# EAGLE board foo (EAGLE 6.6.0), part 1 of 2
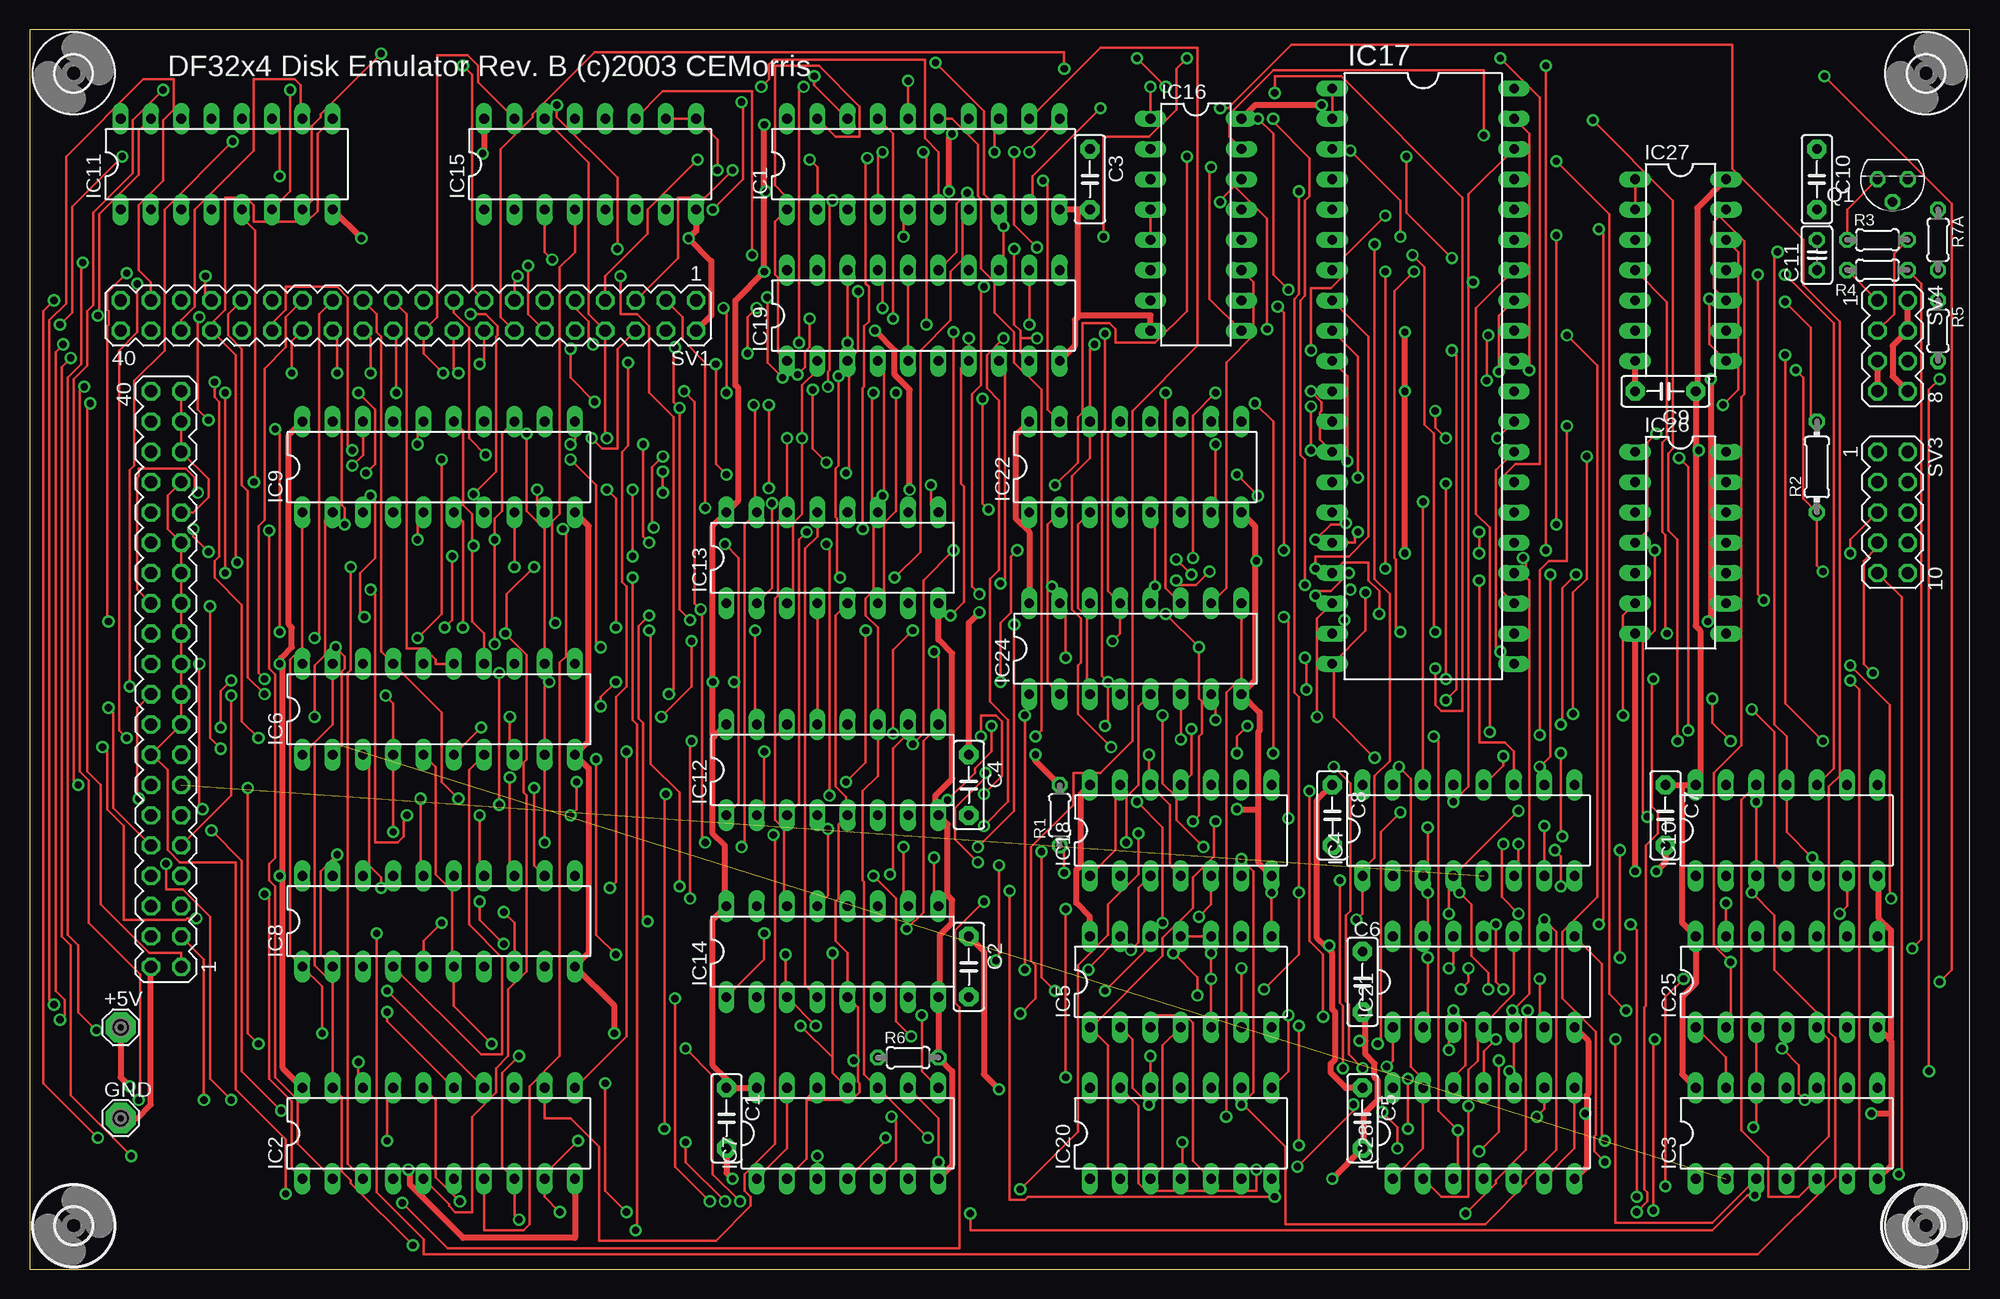
[diagram p2: board, top side]
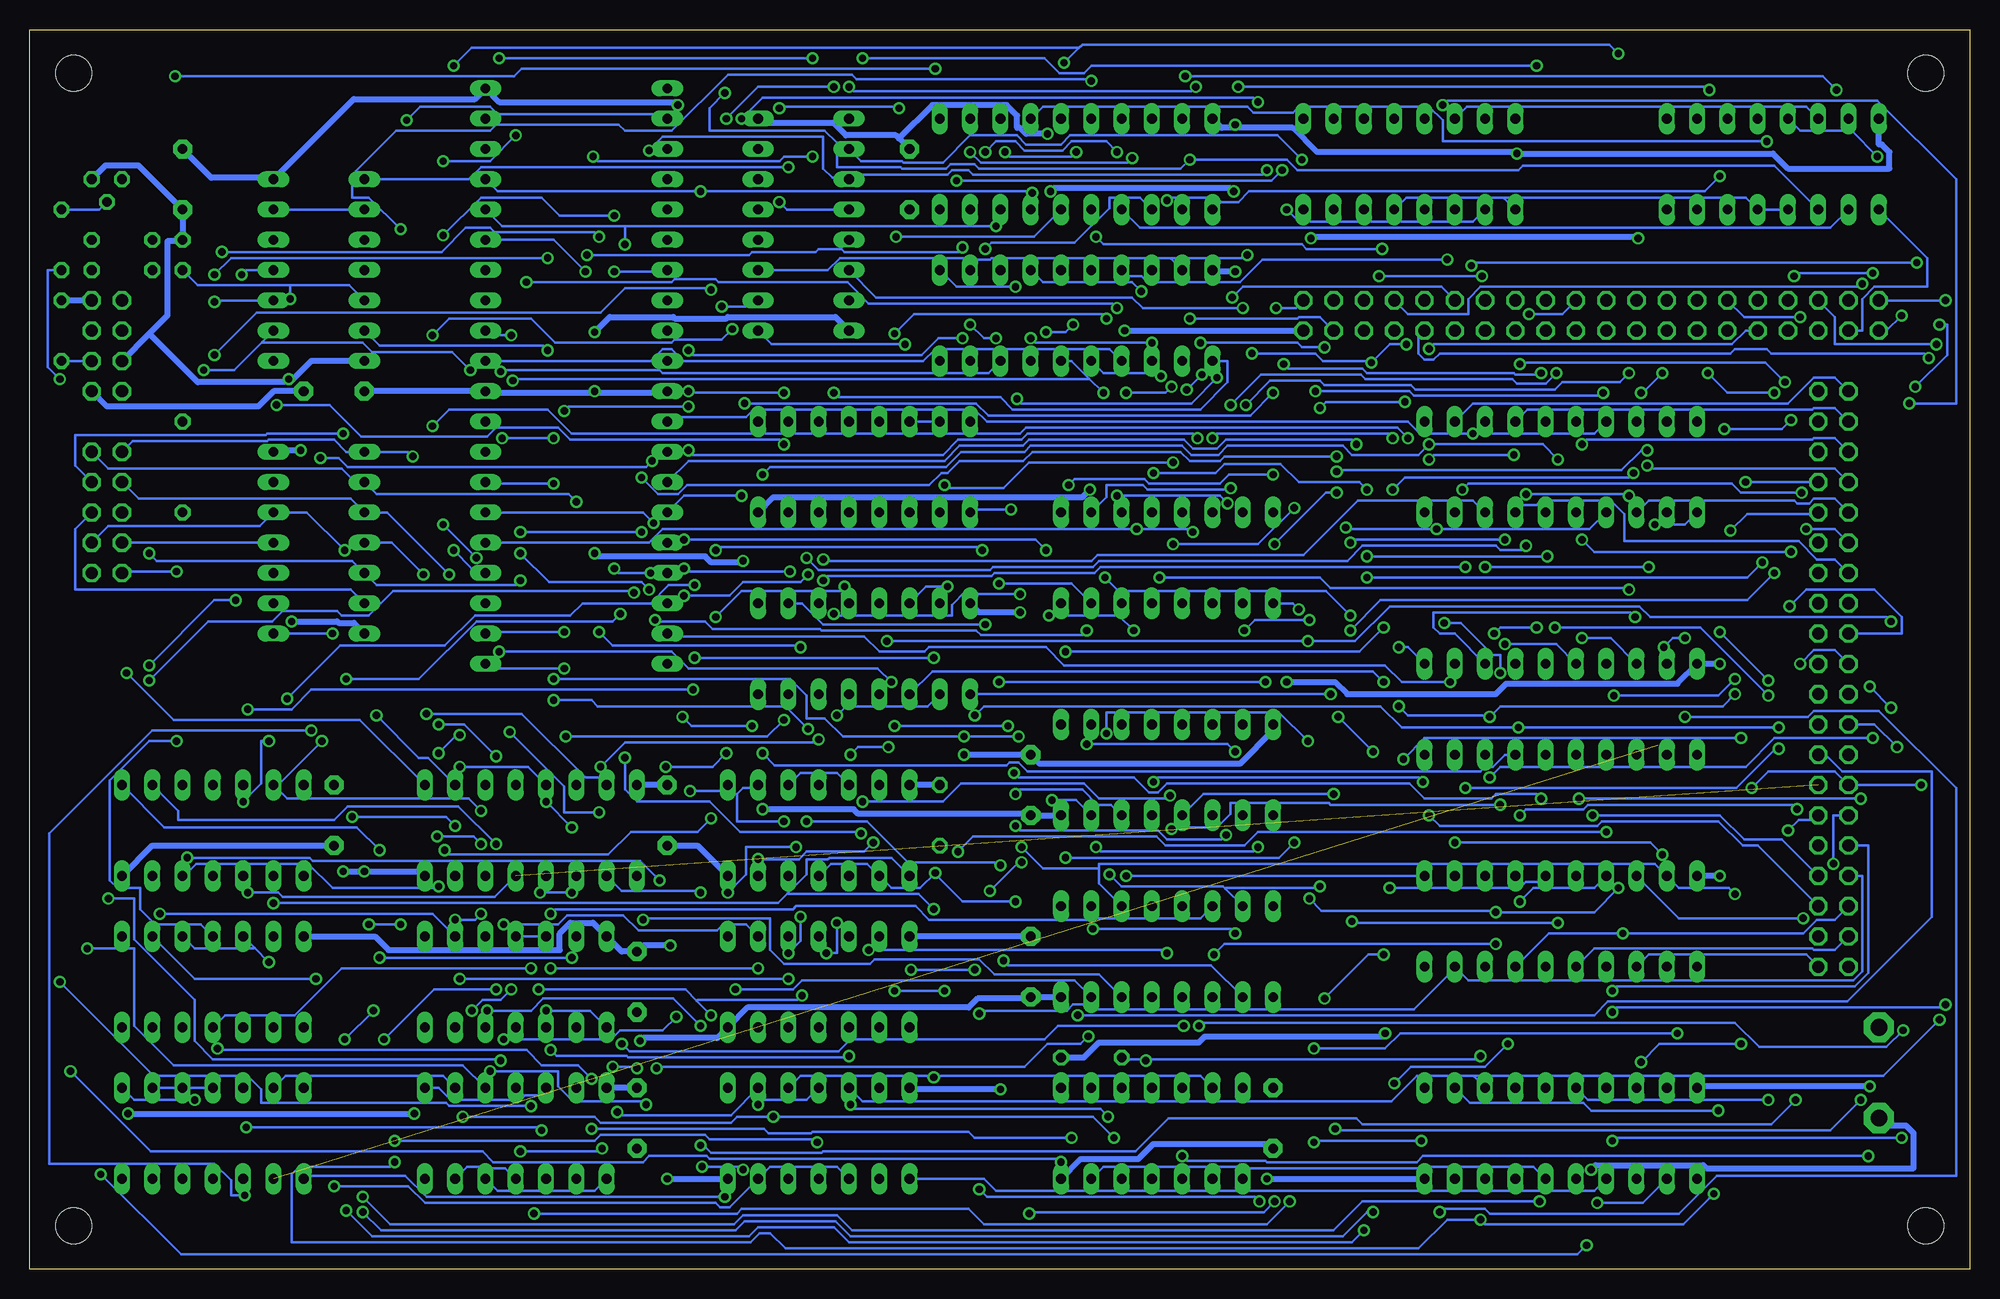
[diagram p3: board, bottom side, seen from below]

Size 162.67 x 103.94 mm. Coordinates in mm from the lower left corner, seen from the top.
Outline: 0,0 162.67,0 162.67,103.94 0,103.94 0,0
Copper layers (1*16): Top 0.035mm / dielectric 1.5mm / Bottom 0.035mm
Design rules "default *": minimum track width 8mil, minimum drill 24mil, track to track 8mil, track to pad 8mil, pad to pad 8mil, via to via 8mil, smd to smd 8mil, copper to edge 40mil, drill to drill 8mil, minimum pad ring 10mil, minimum via ring 8mil, stop-mask expansion 4mil, vias tented up to drill 0mil, thermal gap 10mil
Net classes: 1 supply: width 0.508 mm

## Footprints (pad centres in the part's own frame; a part is rotated, then mirrored left to right if it is on the bottom)
SE14 = drill 1.397 pad 2.54 octagon: MP 0,0
C5B2.5 = drill 0.813 pad 1.6 octagon: 1 -2.54,0; 2 2.54,0
C025-025X050 = drill 0.813 octagon: 1 -1.27,0; 2 1.27,0
DIL20 = drill 0.813 long: 1 -11.43,-3.81; 2 -8.89,-3.81; 3 -6.35,-3.81; 4 -3.81,-3.81; 5 -1.27,-3.81; 6 1.27,-3.81; 7 3.81,-3.81; 8 6.35,-3.81; 9 8.89,-3.81; 10 11.43,-3.81; 11 11.43,3.81; 12 8.89,3.81; 13 6.35,3.81; 14 3.81,3.81; 15 1.27,3.81; 16 -1.27,3.81; 17 -3.81,3.81; 18 -6.35,3.81; 19 -8.89,3.81; 20 -11.43,3.81
DIL14 = drill 0.813 long: 1 -7.62,-3.81; 2 -5.08,-3.81; 3 -2.54,-3.81; 4 0,-3.81; 5 2.54,-3.81; 6 5.08,-3.81; 7 7.62,-3.81; 8 7.62,3.81; 9 5.08,3.81; 10 2.54,3.81; 11 0,3.81; 12 -2.54,3.81; 13 -5.08,3.81; 14 -7.62,3.81
DIL16 = drill 0.813 long: 1 -8.89,-3.81; 2 -6.35,-3.81; 3 -3.81,-3.81; 4 -1.27,-3.81; 5 1.27,-3.81; 6 3.81,-3.81; 7 6.35,-3.81; 8 8.89,-3.81; 9 8.89,3.81; 10 6.35,3.81; 11 3.81,3.81; 12 1.27,3.81; 13 -1.27,3.81; 14 -3.81,3.81; 15 -6.35,3.81; 16 -8.89,3.81
DIL40 = drill 0.813 long: 1 -24.13,-7.62; 2 -21.59,-7.62; 3 -19.05,-7.62; 4 -16.51,-7.62; 5 -13.97,-7.62; 6 -11.43,-7.62; 7 -8.89,-7.62; 8 -6.35,-7.62; 9 -3.81,-7.62; 10 -1.27,-7.62; 11 1.27,-7.62; 12 3.81,-7.62; 13 6.35,-7.62; 14 8.89,-7.62; 15 11.43,-7.62; 16 13.97,-7.62; 17 16.51,-7.62; 18 19.05,-7.62; 19 21.59,-7.62; 20 24.13,-7.62; 21 24.13,7.62; 22 21.59,7.62; 23 19.05,7.62; 24 16.51,7.62; 25 13.97,7.62; 26 11.43,7.62; 27 8.89,7.62; 28 6.35,7.62; 29 3.81,7.62; 30 1.27,7.62; 31 -1.27,7.62; 32 -3.81,7.62; 33 -6.35,7.62; 34 -8.89,7.62; 35 -11.43,7.62; 36 -13.97,7.62; 37 -16.51,7.62; 38 -19.05,7.62; 39 -21.59,7.62; 40 -24.13,7.62
TO92 = drill 0.813 octagon: 1 1.27,0; 2 0,1.905; 3 -1.27,0
0204/5 = drill 0.813 octagon: 1 -2.54,0; 2 2.54,0
0204/7 = drill 0.813 octagon: 1 -3.81,0; 2 3.81,0
MA20-2 = drill 1.016 octagon: 1 -24.13,-1.27; 2 -24.13,1.27; 3 -21.59,-1.27; 4 -21.59,1.27; 5 -19.05,-1.27; 6 -19.05,1.27; 7 -16.51,-1.27; 8 -16.51,1.27; 9 -13.97,-1.27; 10 -13.97,1.27; 11 -11.43,-1.27; 12 -11.43,1.27; 13 -8.89,-1.27; 14 -8.89,1.27; 15 -6.35,-1.27; 16 -6.35,1.27; 17 -3.81,-1.27; 18 -3.81,1.27; 19 -1.27,-1.27; 20 -1.27,1.27; 21 1.27,-1.27; 22 1.27,1.27; 23 3.81,-1.27; 24 3.81,1.27; 25 6.35,-1.27; 26 6.35,1.27; 27 8.89,-1.27; 28 8.89,1.27; 29 11.43,-1.27; 30 11.43,1.27; 31 13.97,-1.27; 32 13.97,1.27; 33 16.51,-1.27; 34 16.51,1.27; 35 19.05,-1.27; 36 19.05,1.27; 37 21.59,-1.27; 38 21.59,1.27; 39 24.13,-1.27; 40 24.13,1.27
MA05-2 = drill 1.016 octagon: 1 -5.08,-1.27; 2 -5.08,1.27; 3 -2.54,-1.27; 4 -2.54,1.27; 5 0,-1.27; 6 0,1.27; 7 2.54,-1.27; 8 2.54,1.27; 9 5.08,-1.27; 10 5.08,1.27
MA04-2 = drill 1.016 octagon: 1 -3.81,-1.27; 2 -3.81,1.27; 3 -1.27,-1.27; 4 -1.27,1.27; 5 1.27,-1.27; 6 1.27,1.27; 7 3.81,-1.27; 8 3.81,1.27
3,0 = hole 3: 0,0

## Placement (x,y rotation side)
+5V  SE14  [SE14]  7.62,20.28 0 top
C1  [C5B2.5]  58.41,12.66 270 top
C2  [C5B2.5]  78.73,25.36 270 top
C3  [C5B2.5]  88.9,91.4 270 top
C4  [C5B2.5]  78.73,40.6 270 top
C5  [C5B2.5]  111.76,12.66 270 top
C6  [C5B2.5]  111.76,24.09 270 top
C7  [C5B2.5]  137.16,38.06 270 top
C8  [C5B2.5]  109.22,38.06 270 top
C9  [C5B2.5]  137.16,73.62 180 top
C10  [C5B2.5]  149.86,91.4 270 top
C11  [C025-025X050]  149.86,85.05 90 top
GND  SE14  [SE14]  7.62,12.66 0 top
IC1  74LS240N  [DIL20]  74.93,92.67 0 top
IC2  74LS244N  [DIL20]  34.28,11.39 0 top
IC3  74LS00N  [DIL14]  147.31,11.39 0 top
IC4  74LS138N  [DIL16]  120.65,36.79 0 top
IC5  74LS32N  [DIL14]  96.52,24.09 0 top
IC6  74LS244N  [DIL20]  34.28,46.95 0 top
IC7  74LS74N  [DIL14]  68.58,11.39 0 top
IC8  74LS240N  [DIL20]  34.28,29.17 0 top
IC9  74LS240N  [DIL20]  34.28,67.27 0 top
IC10  74LS04N  [DIL14]  147.31,36.79 0 top
IC11  74LS191N  [DIL16]  16.51,92.67 0 top
IC12  74LS191N  [DIL16]  67.31,41.87 0 top
IC13  74LS191N  [DIL16]  67.31,59.65 0 top
IC14  74LS191N  [DIL16]  67.31,26.63 0 top
IC15  74LS191N  [DIL16]  46.98,92.67 0 top
IC16  74LS191N  [DIL16]  97.79,87.59 270 top
IC17  DS1258  [DIL40]  116.84,74.89 270 top
IC18  74LS74N  [DIL14]  96.52,36.79 0 top
IC19  74LS240N  [DIL20]  74.93,79.97 0 top
IC20  74LS02N  [DIL14]  96.52,11.39 0 top
IC21  74LS01N  [DIL14]  121.92,24.09 0 top
IC22  74LS155N  [DIL16]  92.7,67.27 0 top
IC24  74LS155N  [DIL16]  92.7,52.03 0 top
IC25  74LS74N  [DIL14]  147.31,24.09 0 top
IC26  74LS30N  [DIL14]  138.43,60.92 270 top
IC27  74LS86N  [DIL14]  138.43,83.78 270 top
IC28  74LS07N  [DIL14]  121.92,11.39 0 top
Q1  2N3904  [TO92]  156.21,91.4 180 top
R1  1K  [0204/5]  86.36,38.06 90 top
R2  1K  [0204/7]  149.86,67.27 90 top
R3  220  [0204/5]  154.94,83.78 0 top
R4  220  [0204/5]  154.94,86.32 180 top
R5  220  [0204/5]  160.02,78.7 270 top
R6  0  [0204/5]  73.66,17.74 0 top
R7A  4.7K  [0204/5]  160.02,86.32 270 top
SV1  BUS1  [MA20-2]  31.75,79.97 180 top
SV2  BUS2  [MA20-2]  11.42,49.49 90 top
SV3  WRLOCK  [MA05-2]  156.21,63.46 270 top
SV4  PANEL LEDS  [MA04-2]  156.21,77.43 270 top
U$1  [3,0]  3.68,100.29 0 top
U$2  [3,0]  3.68,3.65 0 top
U$3  [3,0]  159,3.65 0 top
U$4  [3,0]  159,100.29 0 top

## Tracks (layer width: path | path; a pad name or v marks a point on that pad's centre or on a via)
0V  (via drill 0.61)
  Top 0.203: SV2.33 11.55,64.86 11.55,62.07 SV2.29 SV2.27 SV2.25 SV2.23 SV2.21 SV2.19 SV2.17 SV2.16 10.28,43.14 11.55,41.87 11.55,35.14 12.57,34.12 17.27,34.12 17.27,15.07 21.46,10.88 v21.46,6.31 | v18.79,66 18.92,66.13 18.92,87.08 17.78,88.23 IC11.5 | IC7.2 65.15,9.23 65.15,14.19 | 65.15,14.19 65.15,14.31 IC7.12 | 69.46,17.49 69.46,15.71 69.59,15.58 69.59,14.82 68.96,14.19 65.15,14.19 | 69.46,17.49 69.46,21.93 IC14.5 68.58,26.5 67.56,27.52 67.56,30.82 67.81,31.08 67.81,37.3 IC12.5 68.45,38.06 68.45,39.59 67.56,40.48 67.56,54.83 IC13.5 | IC16.4 IC16.5 | 101.02,90.83 99.82,89.62 v99.82,89.5 | 101.02,90.83 IC16.14 | v41.02,17.87 39.62,16.47 39.62,8.6 IC2.8 40.63,4.53 v41.02,4.15 | 101.02,90.83 103.75,88.1 v103.75,78.83 | v128.9,78.32 131.44,75.78 131.44,31.2 128.52,28.28 128.52,22.7 131.31,19.9 131.31,11.27 131.19,11.14 131.19,9.87 v132.08,8.98 | v69.08,17.49 69.46,17.49
  Bottom 0.203: IC11.4 IC11.5 18.79,89.88 38.98,89.88 39.05,89.81 | 39.05,89.81 39.11,89.88 47.24,89.88 IC15.5 | 39.05,89.81 IC15.1 | v18.79,66 SV2.33 | v99.82,89.5 99.18,88.86 IC16.4 | v41.02,17.87 41.27,17.61 69.08,17.61 | 69.08,17.61 70.99,17.61 R6.1 | v103.75,78.83 104.64,77.94 108.58,77.94 108.83,77.69 118.61,77.69 120.65,79.72 127.5,79.72 v128.9,78.32 | v132.08,8.98 132.46,8.6 140.08,8.6 140.71,7.96 140.71,2.25 102.23,2.25 101.47,3.01 100.58,3.01 99.31,1.74 46.22,1.74 43.81,4.15 v41.02,4.15 40.63,3.77 24,3.77 v21.46,6.31 | 69.08,17.61 v69.08,17.49
!660-663  (via drill 0.61)
  Top 0.203: IC24.2 85.34,49.24 85.34,57.24 | 85.34,57.24 85.34,62.45 IC22.2 | 85.34,57.24 v85.72,57.24 | v104.14,31.59 IC5.8 | v98.42,35.4 96.13,37.68 96.13,39.59 94.99,40.73 v94.99,46.44
  Bottom 0.203: IC24.14 87.5,57.24 v85.72,57.24 | v104.14,31.59 102.61,33.11 102.61,35.4 v98.42,35.4 | v94.99,46.44 94.23,47.21 87.37,47.21 IC24.2
!(NED+EWL)
  Bottom 0.203: IC2.4 31.49,6.57 81.66,6.57 82.67,7.58 IC20.1
!ACBUS0  (via drill 0.61)
  Top 0.203: v21.08,13.3 17.78,16.6 17.78,34.25 v15.23,36.79 | v83.81,79.21 IC19.12 | v81.66,78.07 80.26,76.67 80.26,73.88 81.28,72.86 81.28,58.64 80.51,57.87 80.51,47.59 82.04,46.06 82.04,39.21 v80.01,37.17 | v62.35,36.41 62.48,36.28 62.48,10.5 59.94,7.96 59.94,6.57 60.45,6.06 60.45,5.3 57.53,2.38 47.75,2.38 47.75,10.25 45.33,12.66 43.17,12.66 IC2.12
  Bottom 0.203: IC2.12 41.9,13.93 32.38,13.93 31.75,13.3 v21.08,13.3 | v15.23,36.79 14.35,37.68 13.08,37.68 SV2.11 | v83.81,79.21 82.67,78.07 v81.66,78.07 | v80.01,37.17 79.62,36.79 68.07,36.79 67.31,36.03 62.73,36.03 v62.35,36.41
!ACBUS1  (via drill 0.61)
  Top 0.203: v69.46,82 69.46,77.05 IC19.3 68.7,76.16 68.7,67.02 v68.45,66.76 | SV2.9 16.89,39.71 v16.89,48.1 | v34.79,53.81 35.43,54.45 v35.43,59.78 | v50.54,65.37 v50.54,59.78
  Bottom 0.203: v69.46,82 70.23,82.77 77.72,82.77 IC19.14 | v16.89,48.1 22.6,53.81 v34.79,53.81 | v50.54,59.78 v35.43,59.78 | v50.54,65.37 51.18,66 56.26,66 57.78,67.53 62.48,67.53 63.24,66.76 v68.45,66.76
!ACBUS2  (via drill 0.61)
  Top 0.203: IC19.16 IC19.5 | v31.62,38.06 31.36,37.81 31.36,36.28 30.86,35.78 28.95,35.78 28.95,56.6 v28.57,56.99 | v67.94,58 67.69,58.26 67.69,62.95 67.56,63.08 67.56,67.15 67.81,67.4 v67.81,74.89
  Bottom 0.203: SV2.7 15.74,36.03 18.92,36.03 20.95,38.06 v31.62,38.06 | v28.57,56.99 28.7,57.11 53.59,57.11 54.48,58 v67.94,58 | v67.81,74.89 68.07,75.15 72.64,75.15 IC19.5
!ACBUS3  (via drill 0.61)
  Top 0.203: v68.58,77.69 IC19.18 | v78.73,78.07 IC19.7 78.1,75.53 78.1,65.88 78.35,65.62 78.35,55.97 v77.21,54.83 | v45.33,38.06 45.84,38.57 v45.84,40.86 | v68.45,40.86 70.1,42.51 v70.1,53.56
  Bottom 0.203: v68.58,77.69 78.35,77.69 v78.73,78.07 | SV2.5 17.78,35.52 19.05,35.52 21.08,37.55 30.86,37.55 31.24,37.17 44.45,37.17 v45.33,38.06 | v45.84,40.86 46.22,41.24 68.07,41.24 v68.45,40.86 | v70.1,53.56 71.37,54.83 v77.21,54.83
!ACBUS4  (via drill 0.61)
  Top 0.203: IC19.9 83.05,76.92 83.05,78.07 | 83.05,78.07 83.05,78.7 82.55,79.21 v82.55,85.56 | SV2.3 14.6,26 v14.6,14.19 | v106.42,20.41 v106.42,10.38 | v124.33,21.68 125.73,23.08 125.73,57.75 125.47,58 125.47,59.4 v125.22,59.65 | v128.01,86.7 v128.01,62.45 | v113.66,88.35 110.23,84.92 110.23,83.4 109.09,82.26 107.44,82.26 v107.44,77.05 | 83.05,78.07 v84.45,78.07
  Bottom 0.203: v82.55,85.56 82.04,86.07 75.05,86.07 72.13,88.99 72.13,89.88 69.59,89.88 IC1.3 | v14.6,14.19 16.63,12.15 50.92,12.15 51.43,12.66 67.18,12.66 69.97,9.87 96.13,9.87 96.26,9.74 105.53,9.74 106.17,10.38 v106.42,10.38 | v106.42,20.41 108.71,22.7 119.63,22.7 120.65,21.68 v124.33,21.68 | v128.01,62.45 v125.22,59.65 | v128.01,86.7 124.84,89.88 119.76,89.88 118.23,88.35 v113.66,88.35 | v107.44,77.05 107.06,76.67 87.88,76.67 86.48,78.07 v84.45,78.07
!ACBUS5  (via drill 0.61)
  Top 0.203: IC1.5 73.27,88.48 v73.27,86.58 | v49.27,85.56 49.27,91.53 44.19,96.61 v44.19,97.62 | v5.08,72.61 4.82,72.35 4.82,41.75 5.96,40.6 5.96,30.57 10.03,26.5 12.69,26.5 SV2.1
  Bottom 0.203: IC8.3 26.92,26.38 13.71,26.38 SV2.1 | v73.27,86.58 72.64,85.94 56,85.94 55.62,85.56 v49.27,85.56 | v44.19,97.62 43.81,98.01 7.74,98.01 1.14,91.4 1.14,72.61 v5.08,72.61
!ACBUS6  (via drill 0.61)
  Top 0.203: IC1.7 78.23,88.35 78.23,84.67 77.21,83.66 77.21,79.59 74.67,77.05 74.67,60.16 v72.51,58 | v51.94,54.83 51.05,53.94 51.05,46.19 51.43,45.81 51.43,29.55 v51.81,29.17 | v34.54,29.04 33.02,27.52 IC8.5
  Bottom 0.203: IC8.5 31.49,26.89 13.2,26.89 13.08,26.76 11.3,26.76 SV2.4 | v72.51,58 71.37,56.86 53.97,56.86 v51.94,54.83 | v51.81,29.17 51.68,29.04 v34.54,29.04
!ACBUS7  (via drill 0.61)
  Top 0.203: IC1.9 84.07,89.12 84.07,91.66 v89.78,97.37 | v99.82,97.37 100.45,97.37 105.79,102.7 142.74,102.7 142.74,92.29 148.71,86.32 148.71,82.51 151.76,79.46 151.76,41.36 150.87,40.48 150.87,19.9 151.38,19.39 151.38,7.71 144.9,1.23 33.02,1.23 33.02,2.5 29.08,6.44 v29.08,28.16
  Bottom 0.203: IC8.7 35.3,28.16 v29.08,28.16 13.96,28.16 12.82,29.3 11.3,29.3 SV2.6 | v89.78,97.37 89.91,97.5 99.69,97.5 v99.82,97.37
!ACBUS8  (via drill 0.61)
  Top 0.203: IC1.12 89.78,102.45 97.91,102.45 97.91,77.43 92.45,71.97 92.45,44.29 89.78,41.62 87.5,41.62 87.5,38.95 83.94,35.4 83.94,25.87 84.32,25.49 84.32,22.7 v83.05,21.43
  Bottom 0.203: SV2.8 9.01,32.98 9.01,24.98 9.77,24.22 42.03,24.22 IC8.9 43.17,25.23 46.6,21.81 74.04,21.81 74.42,22.19 75.18,22.19 75.69,21.68 82.8,21.68 v83.05,21.43
!ACBUS9  (via drill 0.61)
  Top 0.203: v29.97,23.33 IC2.14 | v17.01,94.58 11.3,88.86 11.3,77.05 8.76,74.51 8.76,67.4 8.38,67.02 v8.38,48.86 | v6.6,47.08 6.98,46.7 6.98,38.7 SV2.10
  Bottom 0.203: v29.97,23.33 29.59,23.71 9.65,23.71 8.5,24.85 8.5,35.52 SV2.10 | IC1.14 77.72,97.5 60.57,97.5 60.07,96.99 56.76,96.99 56.26,97.5 45.33,97.5 44.19,96.36 44.19,94.58 v17.01,94.58 | v6.6,47.08 v8.38,48.86
!ACBUS10  (via drill 0.61)
  Top 0.203: v16.89,14.19 15.11,15.96 15.11,29.55 12.82,31.84 11.42,31.84 v11.42,34 | v73.66,99.66 IC1.16 | v131.57,87.21 131.95,86.83 131.95,29.3 v131.57,28.92 | v134.23,28.92 134.74,28.41 v134.74,6.06 | v36.06,5.68 34.03,7.71 34.03,14.19 IC2.16
  Bottom 0.203: IC2.16 32,14.19 v16.89,14.19 | v11.42,34 11.42,38.06 SV2.12 | v73.66,99.66 73.78,99.78 93.34,99.78 93.72,100.17 104.14,100.17 108.83,95.47 112.77,95.47 113.28,95.97 123.57,95.97 124.07,95.47 131.95,95.47 135.63,91.78 135.63,89.88 134.23,89.88 v131.57,87.21 | v134.23,28.92 v131.57,28.92 | v134.74,6.06 132.46,3.77 103.63,3.77 102.87,4.53 94.99,4.53 93.72,3.26 53.34,3.26 50.92,5.68 v36.06,5.68
!ACBUS11  (via drill 0.61)
  Top 0.203: IC2.18 27.55,15.58 v27.55,17.36 | v19.17,18.88 18.28,19.77 v18.28,40.35 | IC1.18 65.78,99.28 v65.78,100.04 | v11.17,98.9 8.63,96.36 8.63,91.91 5.33,88.61 5.33,80.86 4.82,80.35 4.82,75.78 3.68,74.64 3.68,40.98 v4.06,40.6
  Bottom 0.203: v27.55,17.36 26.03,18.88 v19.17,18.88 | v18.28,40.35 16.89,41.75 11.3,41.75 SV2.14 v4.06,40.6 | v65.78,100.04 12.31,100.04 v11.17,98.9
!ACCLEAR  (via drill 0.61)
  Top 0.203: v119.38,21.68 120.39,20.66 120.39,17.11 119.38,16.09 IC28.12 | v58.16,80.61 58.41,80.35 v58.41,73.5 | v102.74,72.61 104.26,71.08 v104.26,43.27 | v109.34,42.13 110.74,40.73 110.74,30.06 110.36,29.68 110.36,22.44 110.61,22.19 110.61,18 v111.76,16.85 | v113.79,16.98 114.3,17.49 IC21.1 | IC28.6 129.53,10.12 IC28.8
  Bottom 0.203: IC28.4 122.8,8.47 123.95,8.47 124.07,8.6 125.98,8.6 IC28.6 | IC28.12 120.01,14.57 121.15,14.57 121.53,14.19 127.38,14.19 128.39,15.2 IC28.8 | IC21.1 115.69,21.68 v119.38,21.68 | SV1.1 56.51,80.61 v58.16,80.61 | v58.41,73.5 60.32,71.59 82.29,71.59 83.31,72.61 v102.74,72.61 | v104.26,43.27 105.41,42.13 v109.34,42.13 | v111.76,16.85 111.88,16.98 v113.79,16.98
!BADDAC  (via drill 0.61)
  Top 0.203: v66.04,9.49 IC7.3 | v8.5,9.49 3.42,14.57 3.42,27.14 2.66,27.9 2.66,75.65 v3.42,76.42
  Bottom 0.203: v66.04,9.49 65.65,9.11 59.05,9.11 58.92,8.98 46.35,8.98 45.84,9.49 v8.5,9.49 | v3.42,76.42 3.81,76.8 16.63,76.8 17.01,77.18 19.68,77.18 20.06,76.8 44.45,76.8 44.95,76.29 45.71,76.29 46.22,76.8 46.22,78.7 SV1.10
!BBREAK  (via drill 0.61)
  Top 0.203: IC17.1 IC17.2 | v124.84,38.44 IC4.4 118.99,32.6 v118.99,29.81 | v131.06,96.36 137.79,89.62 137.79,68.8 137.41,68.42 137.41,61.94 138.17,61.18 v138.17,44.29 | IC14.14 63.24,30.7 63.24,36.92 62.48,37.68 62.48,44.67 62.54,44.73 | IC12.14 62.54,44.73 | 62.54,44.73 62.48,44.79 62.48,56.22 62.73,56.48 62.73,62.7 IC13.14 v63.49,69.69 | IC15.14 46.86,92.8 46.86,80.1 SV1.8 48.25,69.81 v48.38,69.69
  Bottom 0.203: v124.84,38.44 125.85,39.46 141.09,39.46 IC10.13 141.98,40.48 v138.17,44.29 | IC17.2 109.6,96.86 123.44,96.86 124.07,97.5 129.92,97.5 v131.06,96.36 | IC11.14 13.71,97.5 42.16,97.5 IC15.14 | v63.49,69.69 63.11,70.07 48.76,70.07 v48.38,69.69 | v118.99,29.81 118.61,30.19 98.67,30.19 98.42,30.44 88.39,30.44 87.24,29.3 74.04,29.3 73.91,29.43 64.51,29.43 IC14.14
!BRK_RQ  (via drill 0.61)
  Top 0.203: IC7.8 74.8,16.6 v74.8,21.3
  Bottom 0.203: v74.8,21.3 31.49,21.3 30.35,22.44 10.28,22.44 3.17,29.55 3.17,41.75 10.66,41.75 12.06,43.14 SV2.15
!BWCO  (via drill 0.61)
  Top 0.203: IC7.11 67.31,16.47 67.31,17.74 | v67.31,26.5 67.31,17.74 | v92.32,26.76 92.96,27.39 92.96,31.97 IC18.3 | SV1.12 41.78,80.1 v41.78,84.16 | v4.44,84.42 4.31,84.29 4.31,75.91 3.17,74.77 3.17,28.03 4.06,27.14 4.06,21.55 v5.58,20.03 | 67.31,17.74 v64.64,20.41
  Bottom 0.203: v67.31,26.5 67.56,26.76 v92.32,26.76 | v41.78,84.16 41.52,84.42 v4.44,84.42 | v5.58,20.03 6.98,18.63 17.65,18.63 19.68,20.66 64.38,20.66 v64.64,20.41
!DATA0  (via drill 0.61)
  Top 0.203: v13.96,29.43 13.2,29.43 13.08,29.3 7.87,29.3 7.87,37.17 6.47,38.57 6.47,43.4 v6.09,43.78
  Bottom 0.203: IC8.18 24.38,29.43 v13.96,29.43 | v6.09,43.78 8,45.68 SV2.18
!DATA1  (via drill 0.61)
  Top 0.203: IC8.16 32.76,33.24 v32.76,39.46 | v9.14,39.46 9.01,39.59 9.01,47.08 SV2.20
  Bottom 0.203: v9.14,39.46 v32.76,39.46
!DATA2  (via drill 0.61)
  Top 0.203: IC8.14 37.71,33.36 v37.71,38.06 | v14.47,38.57 14.22,38.82 v14.22,50.76
  Bottom 0.203: v37.71,38.06 37.21,38.57 32.38,38.57 32,38.95 14.85,38.95 v14.47,38.57 | v14.22,50.76 13.08,51.91 11.3,51.91 SV2.22
!DATA3  (via drill 0.61)
  Top 0.203: IC8.12 42.29,33.87 v42.29,40.35 | v16,43.65 15.11,44.54 v15.11,55.59
  Bottom 0.203: v42.29,40.35 19.55,40.35 16.25,43.65 v16,43.65 | v15.11,55.59 13.71,56.99 8,56.99 5.71,54.7 5.71,53.3 SV2.24
!DATA4  (via drill 0.61)
  Top 0.203: IC9.9 42.54,64.1 v42.54,65.37 | v14.09,65.11 13.84,65.37 13.84,66.38 13.08,67.15 9.14,67.15 9.14,66.51 9.01,66.38 9.01,56.99 SV2.26
  Bottom 0.203: v42.54,65.37 42.03,65.88 19.93,65.88 19.17,65.11 v14.09,65.11
!DATA5
  Bottom 0.203: IC9.7 37.46,64.1 36.32,64.1 35.94,64.48 30.09,64.48 28.95,63.34 28.95,61.05 14.35,61.05 12.82,59.53 11.3,59.53 SV2.28
!DATA6  (via drill 0.61)
  Top 0.203: IC9.5 32.51,62.95 v32.51,61.18 | v14.98,60.16 13.71,61.43 v13.71,62.07
  Bottom 0.203: v32.51,61.18 31.49,60.16 v14.98,60.16 | v13.71,62.07 11.3,62.07 SV2.30
!DATA7
  Bottom 0.203: IC9.3 26.92,64.48 14.73,64.48 14.47,64.22 13.46,64.22 13.08,64.61 11.3,64.61 SV2.32
!DATA8  (via drill 0.61)
  Top 0.203: IC9.18 27.94,68.29 v27.05,67.4
  Bottom 0.203: v27.05,67.4 26.79,67.15 11.3,67.15 SV2.34
!DATA9  (via drill 0.61)
  Top 0.203: IC9.16 32.51,70.57 v32.51,69.18
  Bottom 0.203: v32.51,69.18 32.13,69.56 13.2,69.56 13.08,69.69 11.3,69.69 SV2.36
!DATA10
  Bottom 0.203: IC9.14 37.08,72.1 13.2,72.1 13.08,72.23 11.3,72.23 SV2.38
!DATA11
  Bottom 0.203: IC9.12 41.65,72.61 15.23,72.61 13.08,74.77 11.3,74.77 SV2.40
!DRL
  Bottom 0.203: IC2.6 36.57,8.6 46.1,8.6 46.22,8.47 60.45,8.47 60.57,8.6 72.64,8.6 IC7.6
!EA  (via drill 0.61)
  Top 0.203: IC10.10 151.25,42 151.25,79.34 v147.19,83.4 | v119.25,84.8 115.44,88.61 v115.44,93.31 | v97.02,93.31 97.02,80.35 94.36,77.69 91.05,77.69 91.05,78.83 90.55,79.34 88.26,79.34 88.26,71.84 87.88,71.46 87.88,67.65 v85.97,65.75 | v66.8,67.65 65.65,68.8 v65.65,73.75 | v64.38,75.02 65.02,75.65 65.02,76.92 65.4,77.31 v65.4,79.72
  Bottom 0.203: v147.19,83.4 145.79,84.8 v119.25,84.8 | v115.44,93.31 115.06,92.93 99.82,92.93 99.44,93.31 v97.02,93.31 | v85.97,65.75 85.72,65.49 81.02,65.49 78.86,67.65 v66.8,67.65 | v64.38,75.02 v65.65,73.75 | v65.4,79.72 56.38,79.72 56.26,79.84 54.48,79.84 SV1.4
!EWL  (via drill 0.61)
  Top 0.203: v107.31,40.09 107.31,27.52 108.45,26.38 v108.45,21.17 | v122.93,19.27 121.92,18.25 IC28.11
  Bottom 0.203: IC18.8 104.64,40.09 v107.31,40.09 | v108.45,21.17 109.6,20.03 113.15,20.03 113.91,19.27 v122.93,19.27
!INT_RQ  (via drill 0.61)
  Top 0.203: IC21.13 117.22,28.28 v117.22,31.59 | v119.88,31.59 120.9,30.57 120.9,26.25 122.3,24.85 v122.3,23.46 | v125.6,21.68 125.47,21.55 125.47,9.99 122.93,7.46 122.93,7.2 v120.39,4.66 | v57.02,5.68 54.1,8.6 v54.1,22.7 | v49.14,26.38 47.49,28.03 v47.49,42.76 | v19.17,44.54 17.78,45.94 17.78,55.72 15.49,58 15.49,59.4 15.87,59.78 15.87,72.73 15.49,73.11 v15.49,74.38 | v37.71,75.91 38.09,76.29 SV1.16
  Bottom 0.203: v119.88,31.59 v117.22,31.59 | v122.3,23.46 123.19,22.57 124.71,22.57 v125.6,21.68 | v120.39,4.66 103.37,4.66 102.99,5.04 83.94,5.04 82.67,3.77 58.92,3.77 v57.02,5.68 | v54.1,22.7 50.41,26.38 v49.14,26.38 | v47.49,42.76 45.71,44.54 v19.17,44.54 | v15.49,74.38 17.14,76.03 37.59,76.03 v37.71,75.91
!IOP4  (via drill 0.61)
  Top 0.203: IC24.15 86.86,55.33 v86.86,51.27 | v106.93,51.27 107.06,51.14 v107.06,48.6 | v144.39,46.95 146.3,45.05 146.3,34 IC10.4
  Bottom 0.203: v106.93,51.27 v86.86,51.27 | v107.06,48.6 139.06,48.6 140.71,46.95 v144.39,46.95
!IOS  (via drill 0.61)
  Top 0.203: IC28.2 118.36,6.06 120.65,6.06 v120.65,13.68 120.65,16.73 121.41,17.49 121.41,19.77 IC21.4 121.92,20.54 124.45,23.08 IC21.10 | SV1.14 39.49,79.84 39.49,93.94 42.16,96.61 42.16,96.86 47.37,102.07 86.74,102.07 v86.74,100.67 | v150.49,100.04 161.16,89.37 161.16,25.11 v160.14,24.09
  Bottom 0.203: v86.74,100.67 121.41,100.67 122.04,100.04 v150.49,100.04 | v160.14,24.09 152.27,16.22 144.39,16.22 143.25,15.07 143.25,13.93 127.76,13.93 127.5,13.68 v120.65,13.68
!IOT601  (via drill 0.61)
  Top 0.203: IC22.7 99.44,63.84 v99.44,69.18 | v141.98,72.48 143.25,73.75 143.25,85.31 IC27.12
  Bottom 0.203: v99.44,69.18 99.82,69.56 117.34,69.56 118.36,70.57 123.57,70.57 124.33,69.81 134.87,69.81 137.54,72.48 v141.98,72.48
!IOT602  (via drill 0.61)
  Top 0.203: IC28.3 119.76,7.96 v119.76,11.65 118.11,13.3 118.11,44.29 v117.72,44.67 | v144.52,11.9 144.78,12.15 IC3.12 IC25.3 | IC24.7 99.44,47.84 v99.44,46.06
  Bottom 0.203: v119.76,11.65 120.01,11.9 v144.52,11.9 | v99.44,46.06 100.83,44.67 v117.72,44.67
!IOT604  (via drill 0.61)
  Top 0.203: IC25.1 142.24,17.74 IC3.13 | IC7.4 71.75,10.76 v71.75,11.01 | v126.36,12.79 127,13.42 IC28.9 | IC24.9 101.59,49.62 100.33,48.35 v100.33,12.79
  Bottom 0.203: v71.75,11.01 73.53,12.79 v100.33,12.79 103.37,12.79 103.88,12.28 114.8,12.28 115.31,12.79 v126.36,12.79 | IC3.13 141.22,16.22 128.01,16.22 IC28.9
!IOT612  (via drill 0.61)
  Top 0.203: IC28.1 116.84,10.12 IC28.13 116.84,15.96 115.82,16.98 115.82,41.11 v114.8,42.13 | v96.52,44.41 IC24.6
  Bottom 0.203: IC28.5 123.44,6.57 115.31,6.57 IC28.1 | v96.52,44.41 96.77,44.16 112.77,44.16 v114.8,42.13
!IOT614  (via drill 0.61)
  Top 0.203: IC2.1 21.97,8.47 21.97,14.06 20.06,15.96 20.06,31.08 v19.68,31.46 | IC24.10 100.33,57.11 100.33,76.03 102.61,78.32 102.61,82.77 IC16.11 | IC15.11 53.08,98.77 60.57,98.77 v60.57,85.05 | v79.5,35.4 82.55,38.44 v82.55,54.06
  Bottom 0.203: v19.68,31.46 20.19,31.97 24.38,31.97 IC8.19 26.41,34 73.02,34 73.02,33.62 | IC14.11 73.02,32.35 73.02,33.62 | 66.99,84.73 67.05,84.8 82.04,84.8 82.16,84.67 83.31,84.67 83.43,84.8 94.74,84.8 95.75,83.78 IC16.11 | 66.99,84.73 IC19.19 | v60.57,85.05 60.83,84.8 66.92,84.8 66.99,84.73 | 73.02,33.62 77.72,33.62 v79.5,35.4 | v82.55,54.06 96.13,54.06 97.91,55.84 IC24.10
!IOT621  (via drill 0.61)
  Top 0.203: IC22.5 94.36,63.08 v94.36,57.24 | v105.15,54.7 105.53,54.32 v105.53,37.81 | v127.88,35.14 128.39,34.63 v128.39,32.09
  Bottom 0.203: v94.36,57.24 94.74,56.86 102.99,56.86 v105.15,54.7 | v105.53,37.81 106.68,36.67 112.26,36.67 114.17,34.76 127.5,34.76 v127.88,35.14 | v128.39,32.09 128.52,31.97 137.28,31.97 139.31,34 148.71,34 149.73,32.98 IC10.5
!IOT622  (via drill 0.61)
  Top 0.203: IC24.5 92.96,47.21 92.96,40.6 91.94,39.59 v91.94,35.78 | v101.59,34.38 102.61,33.36 102.61,14.82 v101.59,13.8 101.72,13.8 105.28,10.25 105.28,3.77 122.04,3.77 125.47,7.2 125.47,7.46 128.01,9.99 128.01,28.28 v127,29.3 | v123.57,35.65 123.44,35.52 123.44,31.2 v124.84,29.81
  Bottom 0.203: v91.94,35.78 92.7,35.01 97.53,35.01 98.17,34.38 v101.59,34.38 | v101.59,13.8 101.21,14.19 97.53,14.19 IC20.11 | IC10.9 150.24,38.44 150.24,37.68 137.16,37.68 136.01,38.82 126.74,38.82 v123.57,35.65 | v124.84,29.81 125.34,29.3 v127,29.3
!IOT624  (via drill 0.61)
  Top 0.203: IC19.1 62.73,76.92 62.73,83.15 62.48,83.4 62.48,87.85 IC1.1 63.37,88.86 63.37,90.01 62.48,90.89 62.48,100.93 66.16,100.93 69.59,97.5 69.59,94.96 67.56,94.96 IC1.19 | IC24.11 95.25,57.11 v95.25,73.5
  Bottom 0.203: v95.25,73.5 94.86,73.11 81.28,73.11 80.26,72.1 64.51,72.1 62.22,74.38 62.22,76.16 IC19.1
!LAD  (via drill 0.61)
  Top 0.203: IC11.11 20.95,95.85 v20.95,91.66 | v67.31,89.62 67.05,89.37 67.05,75.4 66.92,75.27 v66.92,74 | v70.73,73.5 70.61,73.37 70.61,63.84 70.99,63.46 IC13.11 70.73,63.08 70.73,56.86 70.1,56.22 70.1,54.83 71.12,53.81 IC12.11 71.12,41.36 69.84,40.09 69.84,32.6 69.97,32.47 69.97,16.34 IC7.10 v75.31,11.01 | v148.84,14.19 148.33,14.69 148.33,17.11 v146.93,18.5 | v115.56,11.77 v115.56,15.96
  Bottom 0.203: v20.95,91.66 22.22,90.39 60.45,90.39 61.34,89.5 62.73,89.5 63.11,89.88 67.05,89.88 v67.31,89.62 | v66.92,74 67.43,73.5 v70.73,73.5 | IC3.8 153.92,14.19 v148.84,14.19 | v146.93,18.5 146.81,18.38 121.03,18.38 119.76,17.11 116.71,17.11 v115.56,15.96 | v115.56,11.77 101.09,11.77 100.71,11.39 97.15,11.39 97.02,11.52 83.94,11.52 83.43,11.01 v75.31,11.01
!OE  (via drill 0.61)
  Top 0.203: IC9.1 22.86,52.16 21.84,51.14 21.84,26.38 IC8.1 24.51,23.71 v24.51,19.77 | IC9.19 26.16,70.32 26.16,64.1 26.41,63.84 v26.41,62.45 | v112.01,56.73 112.01,53.56 IC17.20 109.34,50.76 109.34,46.32 v112.77,42.89 | v152.65,49.37 153.41,48.6 153.41,8.6 IC3.6 | v54.99,18.5 57.27,16.22 57.27,7.96 v59.56,5.68 | v83.05,6.69 87.88,11.52 87.88,25.49 90.42,28.03 90.42,30.57 92.96,33.11 v92.96,36.54
  Bottom 0.203: v26.41,62.45 23.87,62.45 IC9.1 | v112.01,56.73 112.14,56.86 132.2,56.86 134.23,54.83 136.52,54.83 136.9,55.21 141.47,55.21 142.36,54.32 147.7,54.32 v152.65,49.37 | v24.51,19.77 47.75,19.77 49.02,18.5 v54.99,18.5 | v59.56,5.68 59.94,6.06 82.42,6.06 v83.05,6.69 | v92.96,36.54 93.09,36.67 103.12,36.67 105.66,39.21 111.76,39.21 112.77,40.22 v112.77,42.89
!SCL  (via drill 0.61)
  Top 0.203: IC7.1 63.49,10.12 IC7.13 | IC18.1 91.05,35.14 91.05,40.22 IC18.13 | v142.24,30.7 IC25.13 | v86.86,30.19 v86.86,16.09
  Bottom 0.203: IC20.10 98.04,16.22 86.86,16.22 | 86.86,16.22 64.51,16.22 IC7.13 | v142.24,30.7 99.94,30.7 99.12,31.52 | 99.12,31.52 97.53,33.11 97.53,34.38 95.75,34.38 95.63,34.51 90.42,34.51 IC18.1 | v86.86,16.09 86.86,16.22 | v86.86,30.19 88.13,31.46 99.06,31.46 99.12,31.52
!WE  (via drill 0.61)
  Top 0.203: 23.81,44.1 25.39,45.68 IC6.19 | 23.81,44.1 IC6.1 | 23.81,44.1 23.87,44.03 23.87,25.49 25.39,23.96 IC2.19 26.16,14.44 26.16,8.22 26.92,7.46 26.92,7.2 v32.13,1.99 | v148.08,75.4 148.71,74.77 148.71,64.61 R2.1 149.86,59.02 v150.36,58.51 | IC17.39 125.73,95.21 v125.73,75.4 | v156.71,7.96 156.97,8.22 156.97,56.35 SV3.9
  Bottom 0.203: 143.19,77.75 145.54,75.4 v148.08,75.4 | 143.19,77.75 IC27.9 | v125.73,75.4 127.25,76.92 133.98,76.92 134.74,77.69 143.12,77.69 143.19,77.75 | SV3.9 154.81,58.51 v150.36,58.51 | v32.13,1.99 32.89,1.23 149.98,1.23 v156.71,7.96
!WR1  (via drill 0.61)
  Top 0.203: v129.41,46.57 129.41,56.73 130.55,57.87 v130.55,68.16
  Bottom 0.203: IC4.15 114.93,41.24 116.07,41.24 121.41,46.57 v129.41,46.57 | v130.55,68.16 130.93,68.54 IC26.1 136.14,68.54 137.16,69.56 142.62,69.56 142.74,69.43 154.05,69.43 SV3.1
!WR2  (via drill 0.61)
  Top 0.203: v116.84,64.35 IC4.14
  Bottom 0.203: v116.84,64.35 117.47,64.99 133.6,64.99 IC26.2 135.38,66 136.52,67.15 156.08,67.15 SV3.2
!WR3  (via drill 0.61)
  Top 0.203: v126.61,42.13 127.5,43.02 v127.5,58.26
  Bottom 0.203: IC4.13 120.9,42.13 v126.61,42.13 | v127.5,58.26 132.71,63.46 IC26.3 135.76,64.61 153.54,64.61 SV3.3
!WR4  (via drill 0.61)
  Top 0.203: IC4.12 123.57,42.25 v123.57,43.02 | v128.39,45.68 128.52,45.81 128.52,57.11 v129.66,58.26 | v136.39,70.07 135.63,69.3 135.63,61.94 IC26.4
  Bottom 0.203: v123.57,43.02 126.23,45.68 v128.39,45.68 | v129.66,58.26 132.33,60.92 IC26.4 | SV3.4 158.87,67.4 158.87,69.94 142.87,69.94 142.74,70.07 v136.39,70.07
!WR5  (via drill 0.61)
  Top 0.203: IC4.11 124.45,43.4 123.69,44.16 121.53,44.16 v121.53,57.75 | SV3.5 152.65,61.18 v152.65,60.03
  Bottom 0.203: v121.53,57.75 121.92,57.37 133.6,57.37 IC26.5 135.63,59.4 152.01,59.4 v152.65,60.03
!WR6  (via drill 0.61)
  Top 0.203: v133.6,46.44 133.6,54.83 IC26.6
  Bottom 0.203: IC4.10 129.28,42.89 130.04,42.89 v133.6,46.44 | SV3.6 158.87,62.07 158.87,56.99 135.76,56.99 IC26.6
!WR7  (via drill 0.61)
  Top 0.203: v154.55,50 153.79,50.76 153.79,59.4 154.94,60.54 SV3.7
  Bottom 0.203: IC4.9 135,46.06 150.62,46.06 v154.55,50 | SV3.7 IC26.11
!WR8  (via drill 0.61)
  Top 0.203: v127,37.17 IC4.7 | v135.63,37.94 135.25,38.32 135.25,52.54 136.27,53.56 v136.27,60.29
  Bottom 0.203: v127,37.17 127.76,37.94 v135.63,37.94 | v136.27,60.29 139.44,63.46 IC26.12 143.38,62.32 156.08,62.32 SV3.8
BAC0  (via drill 0.61)
  Top 0.203: IC13.9 75.56,64.1 v75.56,65.75 | v58.41,66.64 57.53,67.53 v57.53,75.91 | v35.94,75.15 35.55,75.53 SV1.18
  Bottom 0.203: v75.56,65.75 75.05,66.26 69.21,66.26 68.83,65.88 62.86,65.88 62.1,66.64 v58.41,66.64 | v57.53,75.91 57.14,75.53 50.92,75.53 50.54,75.15 38.22,75.15 38.09,75.02 36.06,75.02 v35.94,75.15
BAC1  (via drill 0.61)
  Top 0.203: v61.97,72.48 v61.97,65.49 | v34.67,75.15 33.02,76.8 SV1.20 34.16,79.84 34.16,101.82 36.7,101.82 37.59,100.93 37.59,99.53 IC15.15
  Bottom 0.203: IC13.10 72.39,64.73 72.39,65.75 69.34,65.75 68.96,65.37 62.1,65.37 v61.97,65.49 | v61.97,72.48 59.43,75.02 51.05,75.02 50.67,74.64 38.35,74.64 37.97,74.26 35.55,74.26 v34.67,75.15
BAC2  (via drill 0.61)
  Top 0.203: IC14.9 75.81,30.82 v75.81,34.51 | v56.64,35.78 56.38,36.03 56.38,55.21 v56.26,55.33 55.75,55.84 55.75,72.73 v54.86,73.62 | SV1.22 30.73,78.45 v30.73,73.5
  Bottom 0.203: v75.81,34.51 57.91,34.51 v56.64,35.78 | v56.26,55.33 56.76,55.84 IC13.1 | v30.73,73.5 30.98,73.24 46.6,73.24 46.98,73.62 v54.86,73.62
BAC3  (via drill 0.61)
  Top 0.203: IC14.10 73.27,30.82 v73.27,35.4 | v59.68,35.4 59.94,35.65 59.94,62.45 IC13.15 60.83,63.46 60.83,72.35 v60.7,72.48 | SV1.24 28.57,78.07 v28.57,75.15
  Bottom 0.203: v73.27,35.4 72.89,35.01 60.07,35.01 v59.68,35.4 | v28.57,75.15 29.33,74.38 34.16,74.38 34.79,73.75 46.48,73.75 46.86,74.13 54.1,74.13 54.48,74.51 58.67,74.51 v60.7,72.48
BAC4  (via drill 0.61)
  Top 0.203: IC14.1 61.59,26 v61.59,28.16 | v73.53,28.54 74.93,29.93 74.93,44.29 76.2,45.56 IC12.9 76.2,51.4 v75.81,51.78 | SV1.26 25.78,78.32 v25.78,75.15 | v27.55,73.5 28.95,72.1 28.95,67.53 v28.19,66.76 | v48.38,65.37 49.14,64.61 v49.14,53.81
  Bottom 0.203: v61.59,28.16 61.97,28.54 v73.53,28.54 | v25.78,75.15 27.43,73.5 v27.55,73.5 | v28.19,66.76 28.57,66.38 47.37,66.38 v48.38,65.37 | v49.14,53.81 51.18,51.78 v75.81,51.78
BAC5  (via drill 0.61)
  Top 0.203: v72.13,33.11 72.39,33.36 72.39,43.65 73.66,44.92 IC12.10 | SV1.28 21.97,77.81 v21.97,75.15 | v16.38,58.38 v16.38,73.5 | v51.94,53.56 52.06,53.43 52.06,42.38 54.48,39.97 v54.48,32.09
  Bottom 0.203: 62.41,31.9 62.61,32.09 71.12,32.09 v72.13,33.11 | 62.41,31.9 IC14.15 | v21.97,75.15 20.32,73.5 v16.38,73.5 | v16.38,58.38 18.66,56.1 49.4,56.1 v51.94,53.56 | v54.48,32.09 54.6,31.97 62.35,31.97 62.41,31.9
BAC6  (via drill 0.61)
  Top 0.203: IC12.1 59.43,39.08 59.43,49.24 | 59.43,49.24 59.43,59.65 v58.29,60.8 | v53.08,66.89 v53.08,65.11 | v27.05,68.67 26.67,69.05 26.67,81.5 25.78,82.39 21.46,82.39 21.46,80.48 20.32,79.34 SV1.30 | v104.64,80.73 105.15,80.23 v105.15,60.29 | v82.8,60.29 82.29,59.78 82.29,55.08 81.4,54.19 v81.4,49.24 | 59.43,49.24 v59.05,49.24
  Bottom 0.203: v58.29,60.8 53.97,65.11 v53.08,65.11 | v53.08,66.89 52.95,67.02 29.21,67.02 27.55,68.67 v27.05,68.67 | IC16.10 102.1,80.73 v104.64,80.73 | v105.15,60.29 104.9,60.54 83.05,60.54 v82.8,60.29 | v59.05,49.24 v81.4,49.24
BAC7  (via drill 0.61)
  Top 0.203: IC12.15 60.83,45.81 v60.83,53.56 | v55.37,54.45 54.48,55.33 v54.48,72.23 53.97,72.73 53.97,77.18 v54.1,77.31 | v47.37,72.73 45.33,74.77 v45.33,77.18 | v93.98,99.15 IC16.1 | v64.89,99.15 64.51,98.77 v64.51,77.69
  Bottom 0.203: v60.83,53.56 59.94,54.45 v55.37,54.45 | v54.48,72.23 53.97,72.73 v47.37,72.73 | v45.33,77.18 44.95,77.56 19.93,77.56 18.79,78.7 SV1.32 | v93.98,99.15 93.59,98.77 65.27,98.77 v64.89,99.15 | v64.51,77.69 56.38,77.69 56,77.31 v54.1,77.31
BAC8  (via drill 0.61)
  Top 0.203: IC11.9 24.12,95.21 24.12,88.73 23.24,87.85 18.79,87.85 18.79,89.24 18.16,89.88 16.38,89.88 16.38,80.48 15.23,79.34 SV1.34 17.27,76.67 17.27,59.4 v17.39,59.27 | IC16.15 100.58,94.96 100.58,96.86 104.26,100.55 121.92,100.55 v121.92,95.09 | v128.01,92.93 132.46,88.48 132.46,23.08 v133.85,21.68 | v136.27,19.27 136.14,19.14 v136.14,4.92 | v50.79,3.26 50.92,3.39 50.92,45.68 50.54,46.06 v50.54,58
  Bottom 0.203: v121.92,95.09 124.07,92.93 v128.01,92.93 | v136.27,19.27 v133.85,21.68 | v136.14,4.92 133.98,2.76 102.36,2.76 101.59,3.52 95.25,3.52 93.98,2.25 51.81,2.25 v50.79,3.26 | v50.54,58 18.66,58 v17.39,59.27
BAC9
  Top 0.203: IC11.10 22.73,96.61 22.73,99.28 22.22,99.78 18.79,99.78 18.79,93.81 13.84,88.86 13.84,80.73 12.69,79.59 SV1.36
BAC10
  Bottom 0.203: IC11.1 3.55,84.8 3.55,82.39 8,82.39 9.01,81.37 9.01,78.7 SV1.38
BAC11  (via drill 0.61)
  Top 0.203: IC11.15 9.14,95.47 9.14,91.78 5.84,88.48 5.84,80.1 v5.71,79.97
  Bottom 0.203: v5.71,79.97 6.98,78.7 SV1.40
BIOP1  (via drill 0.61)
  Top 0.203: v80.39,63.72 79.88,64.22 v79.88,72.99 | v63.11,74.77 61.84,76.03 v61.84,81.5
  Bottom 0.203: IC22.1 83.56,63.72 v80.39,63.72 | v79.88,72.99 79.5,72.61 65.27,72.61 v63.11,74.77 | v61.84,81.5 60.95,82.39 44.32,82.39 SV1.11
BIOP2  (via drill 0.61)
  Top 0.203: v53.59,48.22 53.97,48.6 53.97,71.46 51.94,73.5 51.94,79.08 50.92,80.1 49.52,80.1 v49.52,83.27 | v40.89,83.27 40.63,83.02 SV1.13
  Bottom 0.203: v53.59,48.22 IC24.1 | v40.89,83.27 v49.52,83.27
BIOP4  (via drill 0.61)
  Top 0.203: v144.78,39.21 IC10.3 | v142.62,44.29 141.09,45.81 v141.09,47.84 | v106.93,57.37 106.93,67.91 106.55,68.29 106.55,81.24 106.93,81.62 106.93,89.62 107.31,90.01 107.31,93.18 104.26,96.23 v104.26,96.48 | v92.83,101.56 v95.25,99.15 | v36.32,100.93 37.08,100.17 37.08,82.26 SV1.15
  Bottom 0.203: v144.78,39.21 143.25,40.73 143.25,44.29 v142.62,44.29 | v141.09,47.84 136.65,52.29 127.88,52.29 125.34,54.83 117.34,54.83 116.33,55.84 110.61,55.84 109.09,57.37 v106.93,57.37 | v104.26,96.48 101.59,99.15 v95.25,99.15 | v92.83,101.56 77.59,101.56 76.32,100.29 74.29,100.29 73.66,100.93 v36.32,100.93
BMB0  (via drill 0.61)
  Top 0.203: v47.87,52.16 47.49,52.54 47.49,65.75 v45.33,67.91 | v38.22,68.29 36.82,69.69 36.82,78.96 35.55,80.23 SV1.17
  Bottom 0.203: IC6.11 47.11,52.16 v47.87,52.16 | v45.33,67.91 44.95,68.29 v38.22,68.29
BMB1  (via drill 0.61)
  Top 0.203: v28.06,54.7 27.68,55.08 27.68,58.38 28.95,59.65 28.95,64.48 v28.57,64.86 | v37.21,64.99 39.11,66.89 39.11,78.19 39.24,78.32 39.24,79.08 38.22,80.1 v36.95,80.1
  Bottom 0.203: IC6.13 43.17,53.3 44.45,53.3 44.95,53.81 44.95,55.08 28.44,55.08 v28.06,54.7 | v28.57,64.86 28.7,64.99 v37.21,64.99 | v36.95,80.1 34.16,80.1 SV1.19
BMB2
  Top 0.203: IC6.15 34.03,50.76 34.03,51.14 33.14,52.03 31.62,52.03 31.62,80.1 SV1.21
BMB3  (via drill 0.61)
  Top 0.203: SV1.23 29.08,80.1 29.08,78.58 29.46,78.19 29.46,51.78 IC6.17 34.54,46.7 34.54,40.86 v35.94,39.46 | v104.39,6.06 83.69,6.06 83.43,5.8 82.16,5.8 v82.16,31.71 | v79.5,34.12 77.59,36.03 77.59,38.7 80.13,41.24 v80.13,41.62
  Bottom 0.203: IC3.1 139.44,7.84 131.19,7.84 129.41,6.06 v104.39,6.06 | v82.16,31.71 79.75,34.12 v79.5,34.12 | v80.13,41.62 79.75,41.24 70.1,41.24 68.83,39.97 68.07,39.97 67.31,40.73 46.98,40.73 45.71,39.46 40.13,39.46 39.75,39.84 36.32,39.84 v35.94,39.46
BMB4  (via drill 0.61)  (1 unrouted)
  Top 0.203: IC6.2 26.16,43.9 26.16,50.13 26.41,50.38 26.41,51.4 v25.65,52.16 | v23.87,52.92 24.25,53.3 24.25,80.1 SV1.25
  Bottom 0.203: v25.65,52.16 24.89,52.92 v23.87,52.92
BMB5  (via drill 0.61)
  Top 0.203: IC5.12 93.47,27.39 93.47,26.63 v90.17,23.33 | v85.97,23.33 84.83,24.47 v84.83,35.01 | v30.48,36.67 IC6.4 30.48,47.46 v29.84,48.1 | SV1.27 21.46,79.84 21.46,77.31 19.68,75.53 19.68,62.83 19.17,62.32 19.17,50 v19.68,49.49
  Bottom 0.203: v85.97,23.33 v90.17,23.33 | v84.83,35.01 83.56,36.28 68.19,36.28 67.43,35.52 60.83,35.52 59.68,36.67 v30.48,36.67 | v19.68,49.49 21.08,48.1 v29.84,48.1
BMB6  (via drill 0.61)
  Top 0.203: IC5.13 88.77,25.23 v88.77,25.11 | v83.43,46.44 v83.43,25.11 | IC6.6 v37.84,45.43 | v14.22,79.84 14.09,79.72 14.09,72.1 v14.98,71.21 | v20.57,70.45 20.95,70.07 v20.95,53.43 | v16.89,49.37 16,48.48 v16,45.43
  Bottom 0.203: v83.43,25.11 v88.77,25.11 | v83.43,46.44 82.67,47.21 49.4,47.21 47.62,45.43 v37.84,45.43 v16,45.43 | SV1.29 18.92,79.84 v14.22,79.84 | v14.98,71.21 15.74,70.45 v20.57,70.45 | v16.89,49.37 v20.95,53.43
BMB7  (via drill 0.61)
  Top 0.203: IC24.3 88.64,48.48 88.64,54.7 87.88,55.46 87.88,62.45 IC22.3 | IC6.8 40.25,43.52 v40.25,46.32 | v19.68,48.22 18.28,49.62 18.28,65.24 17.78,65.75 17.78,77.18 16.63,78.32 16.63,80.1 SV1.31 | v49.14,49.24 47.87,47.97 v47.87,47.21
  Bottom 0.203: v19.68,48.22 20.7,47.21 39.36,47.21 v40.25,46.32 40.25,46.44 47.11,46.44 v47.87,47.21 | IC24.3 86.99,50.13 50.03,50.13 v49.14,49.24
BMB8  (via drill 0.61)
  Top 0.203: IC2.11 50.03,19.52 v50.03,43.4 | v52.95,46.32 55.49,48.86 v55.49,52.67 | v90.8,52.67 91.44,53.3 IC24.13 90.42,56.86 90.42,70.07 IC22.13 | SV1.33 14.73,81.75 v14.73,83.27 | v8.12,83.53 6.47,81.88 6.47,80.48 6.6,80.35 6.6,79.21 6.47,79.08 6.47,54.45 v6.6,54.32
  Bottom 0.203: v52.95,46.32 v50.03,43.4 | v90.8,52.67 v55.49,52.67 51.56,52.67 48.64,55.59 27.68,55.59 26.79,54.7 6.98,54.7 v6.6,54.32 | v14.73,83.27 14.47,83.53 v8.12,83.53
BMB9  (via drill 0.61)
  Top 0.203: IC21.3 118.99,19.9 v118.99,18.38 | IC20.12 v93.98,17.87 | v2.79,77.56 2.15,76.92 2.15,23.33 2.92,22.57 2.92,21.3 v2.54,20.92
  Bottom 0.203: 41.59,16.15 41.65,16.22 46.35,16.22 48.51,14.06 92.83,14.06 IC20.12 | 41.59,16.15 IC2.13 | v118.99,18.38 118.49,17.87 112.64,17.87 112.52,17.74 94.1,17.74 v93.98,17.87 | SV1.35 11.3,79.84 11.3,77.56 v2.79,77.56 | v2.54,20.92 7.23,16.22 41.52,16.22 41.59,16.15
BMB10  (via drill 0.61)
  Top 0.203: IC2.15 29.97,20.79 v29.97,21.55 | v2.03,22.19 1.65,22.57 1.65,79.59 3.04,80.99 3.04,93.31 9.52,99.78 12.06,99.78 12.06,97.24 11.17,96.36 11.17,91.28 9.14,89.24 9.14,83.78 10.15,82.77 SV1.37
  Bottom 0.203: v29.97,21.55 29.59,21.93 2.28,21.93 v2.03,22.19
BMB11  (via drill 0.61)
  Top 0.203: IC2.17 29.97,14.69 v29.97,10.76 | v5.71,11.01 1.14,15.58 1.14,80.35 v2.03,81.24
  Bottom 0.203: v29.97,10.76 29.71,11.01 v5.71,11.01 | SV1.39 v2.03,81.24
BRK_RQ  (via drill 0.61)
  Top 0.203: IC7.9 76.2,12.66 v76.2,8.98 | v159.25,16.6 159.25,73.75 v160.14,74.64
  Bottom 0.203: v76.2,8.98 76.45,9.23 105.66,9.23 105.91,9.49 110.74,9.49 111.25,8.98 123.82,8.98 124.71,9.87 152.52,9.87 v159.25,16.6 | v160.14,74.64 161.16,75.65 161.16,83.78 R7A.2
BTS3  (via drill 0.61)
  Top 0.203: IC4.6 124.84,33.36 v124.84,35.65 | v128.52,36.28 128.39,36.41 v128.39,43.27 | v126.61,44.79 126.61,58.64 127.38,59.4 128.9,59.4 v128.9,70.7 | v47.11,69.69 48,68.8 49.27,68.8 49.27,77.18 SV1.6
  Bottom 0.203: v124.84,35.65 125.47,36.28 v128.52,36.28 | v128.39,43.27 126.87,44.79 v126.61,44.79 | v128.9,70.7 127.5,72.1 119.25,72.1 117.22,70.07 79.62,70.07 79.12,70.57 48,70.57 v47.11,69.69
DATA_IN  (via drill 0.61)  (1 unrouted)
  Top 0.203: IC3.4 150.87,11.14 150.87,19.27 IC25.5 149.86,21.55 146.3,25.11 146.3,29.68 v144.39,31.59
  Bottom 0.203: IC4.5 123.69,31.2 141.47,31.2 141.85,31.59 v144.39,31.59
DISK_LED
  Top 0.203: SV4.3 156.33,80.1 156.33,85.18 R4.1
DMA0  (via drill 0.61)
  Top 0.203: v81.4,57.49 81.78,57.87 81.78,75.65 IC19.8 | IC17.33 123.19,79.97 v123.19,75.27
  Bottom 0.203: IC13.7 75.31,57.49 v81.4,57.49 | v123.19,75.27 123.06,75.4 109.85,75.4 109.6,75.15 82.29,75.15 IC19.8
DMA1  (via drill 0.61)
  Top 0.203: IC13.6 71.62,56.35 71.62,62.57 72.64,63.59 v72.64,73.5 | v122.3,78.32 122.17,78.19 v122.17,74.51
  Bottom 0.203: 73.84,74.7 75.31,76.16 IC19.6 | 73.84,74.7 v72.64,73.5 | IC17.32 124.07,78.32 v122.3,78.32 | v122.17,74.51 122.04,74.64 73.91,74.64 73.84,74.7
DMA2  (via drill 0.61)
  Top 0.203: IC13.2 62.22,57.11 v62.22,64.22 | v71.5,64.86 71.62,64.99 71.62,75.65 IC19.4
  Bottom 0.203: v62.22,64.22 62.86,64.86 v71.5,64.86 | IC17.31 110.61,76.16 109.6,77.18 108.83,77.18 107.82,76.16 87.75,76.16 86.74,77.18 72.13,77.18 IC19.4
DMA3  (via drill 0.61)
  Top 0.203: IC13.3 64,56.35 64,62.57 64.77,63.34 v64.77,69.69 64.77,74.13 66.04,75.4 IC19.2 | v123.06,69.69 IC17.29 | v118.74,69.69 117.85,70.57 v117.85,71.97 | v107.44,68.67 v107.44,72.35
  Bottom 0.203: v118.74,69.69 v123.06,69.69 | v117.85,71.97 117.47,72.35 v107.44,72.35 | v107.44,68.67 107.06,68.29 86.1,68.29 84.83,69.56 79.5,69.56 78.99,70.07 65.15,70.07 v64.77,69.69
DMA4  (via drill 0.61)
  Top 0.203: v76.96,39.33 79.24,41.62 79.24,42 80.64,43.4 v80.64,45.56 | v90.17,45.56 90.42,45.81 v90.42,49.24 89.91,49.75 89.91,70.19 90.17,70.45 v90.17,78.45 | v123.31,51.78 122.93,52.16 122.93,67.02 IC17.28 | IC1.17 72.39,95.21 v72.39,79.72
  Bottom 0.203: IC12.7 74.93,39.33 v76.96,39.33 | v90.17,45.56 v80.64,45.56 | v90.42,49.24 91.56,50.38 107.44,50.38 108.83,51.78 v123.31,51.78 | v72.39,79.72 72.77,80.1 88.51,80.1 v90.17,78.45
DMA5  (via drill 0.61)
  Top 0.203: v80.01,39.84 81.53,41.36 81.53,45.94 81.02,46.44 79.75,46.44 v79.75,44.67 | v84.32,44.67 84.83,45.17 84.83,73.75 82.55,76.03 82.55,78.58 80.89,80.23 80.89,82.77 79.75,83.91 79.75,89.75 79.5,90.01 79.5,94.32 77.34,96.48 IC1.15 | v118.74,49.49 v118.74,65.88
  Bottom 0.203: IC12.6 72,38.95 73.15,38.95 74.42,40.22 79.62,40.22 v80.01,39.84 | v79.75,44.67 v84.32,44.67 94.48,44.67 96.01,46.19 97.53,46.19 97.53,48.1 98.93,49.49 v118.74,49.49 | IC17.27 124.33,65.88 v118.74,65.88
DMA6  (via drill 0.61)
  Top 0.203: IC12.2 61.59,38.7 v61.59,43.4 | v74.04,44.03 74.93,44.92 74.93,57.75 v77.47,60.29 v77.47,78.58 | v107.82,61.18 109.09,62.45 110.36,62.45 v110.36,62.57 | IC1.13 80.89,96.1 v80.89,93.69 | v74.93,93.69 75.18,93.43 v75.18,79.21
  Bottom 0.203: v61.59,43.4 62.22,44.03 v74.04,44.03 | v77.47,60.29 78.35,61.18 v107.82,61.18 | v110.36,62.57 111.25,63.46 IC17.26 | v80.89,93.69 80.51,93.31 75.31,93.31 v74.93,93.69 | v75.18,79.21 75.81,78.58 v77.47,78.58
DMA7  (via drill 0.61)
  Top 0.203: IC12.3 64.51,39.08 64.51,61.18 v65.15,61.81 | IC1.11 83.81,93.94 v83.81,93.69 | v70.23,93.18 70.1,93.05 70.1,82.64 70.35,82.39 70.35,79.46 69.97,79.08 69.97,74 69.84,73.88 v69.84,62.07
  Bottom 0.203: v65.15,61.81 65.4,62.07 v69.84,62.07 109.6,62.07 110.74,60.92 IC17.25 | v83.81,93.69 82.93,92.8 70.61,92.8 v70.23,93.18
DMA8  (via drill 0.61)
  Top 0.203: IC11.7 23.62,89.62 23.62,95.85 24.38,96.61 24.38,96.86 v29.46,101.94 | v75.94,101.18 80.01,97.12 80.01,90.13 IC1.8 | v127.12,100.93 v127.12,60.29
  Bottom 0.203: v29.46,101.94 30.22,102.7 74.42,102.7 74.73,102.39 | v75.94,101.18 74.73,102.39 | IC17.24 124.84,58.76 125.6,58.76 v127.12,60.29 | v127.12,100.93 125.6,102.45 74.8,102.45 74.73,102.39
DMA9  (via drill 0.61)
  Top 0.203: IC11.6 21.84,90.39 v21.84,98.9 | v61.34,99.15 61.97,99.78 61.97,101.05 62.35,101.44 75.05,101.44 75.05,94.83 76.2,93.69 IC1.6 | IC17.23 123.44,56.86 123.44,66.38 124.58,67.53 126.61,67.53 126.61,98.26 v123.31,101.56 | v97.02,101.56 96.13,100.67 96.13,97.24 93.85,94.96 90.04,94.96 v90.04,86.58
  Bottom 0.203: v21.84,98.9 22.09,99.15 v61.34,99.15 | v97.02,101.56 v123.31,101.56 | v90.04,86.58 78.48,86.58 IC1.6
DMA10  (via drill 0.61)
  Top 0.203: v117.85,53.43 117.72,53.56 117.72,70.07 116.96,70.83 116.96,84.04 v115.95,85.05 | v84.45,85.69 82.55,87.59 v82.55,93.69 | v71.5,93.69 71.12,93.31 IC1.4
  Bottom 0.203: IC11.2 11.68,87.34 69.59,87.34 IC1.4 | IC17.22 124.33,53.43 v117.85,53.43 | v115.95,85.05 102.36,85.05 102.1,85.31 96.77,85.31 96.52,85.56 94.61,85.56 94.36,85.31 84.83,85.31 v84.45,85.69 | v82.55,93.69 81.66,94.58 80.01,94.58 79.24,93.81 76.07,93.81 75.31,94.58 72.39,94.58 v71.5,93.69
DMA11  (via drill 0.61)
  Top 0.203: v65.4,93.05 66.04,92.42 IC1.2 | v117.85,50.38 117.85,47.33 118.36,46.83 120.14,46.83 120.14,89.88 109.98,100.04 104.39,100.04 v104.39,98.64
  Bottom 0.203: IC11.3 16.38,92.55 37.46,92.55 37.84,92.16 56.38,92.16 57.27,93.05 v65.4,93.05 66.16,92.29 83.05,92.29 83.43,92.67 85.47,92.67 85.85,92.29 89.53,92.29 89.66,92.42 94.99,92.42 94.99,94.45 96.01,95.47 105.66,95.47 105.66,97.37 v104.39,98.64 | IC17.21 124.07,50.38 v117.85,50.38
DQ0  (via drill 0.61)
  Top 0.203: IC8.2 24.38,26.38 24.38,33.36 v25.78,34.76 | v43.17,35.78 IC6.9 43.17,48.86 v43.56,49.24
  Bottom 0.203: v25.78,34.76 26.79,35.78 v43.17,35.78 | IC17.19 108.96,53.05 92.7,53.05 91.44,51.78 87.62,51.78 87.24,52.16 77.47,52.16 75.94,50.64 49.02,50.64 47.62,49.24 v43.56,49.24
DQ1  (via drill 0.61)
  Top 0.203: IC8.4 37.84,18 39.62,18 39.62,26.12 36.82,28.92 36.82,41.87 IC6.7 | IC17.18 107.95,54.57 v107.95,46.32 | v102.1,45.56 101.21,44.67 v101.21,43.27
  Bottom 0.203: v107.95,46.32 107.18,45.56 v102.1,45.56 | v101.21,43.27 100.2,42.25 80.77,42.25 80.51,42.51 79.75,42.51 78.99,41.75 41.02,41.75 40.63,42.13 40,42.13 38.98,43.14 IC6.7
DQ2  (via drill 0.61)
  Top 0.203: IC6.5 34.03,42.13 34.03,33.11 35.43,31.71 35.43,25.49 IC8.6 35.55,22.06 v38.73,18.88 | IC17.17 110.1,59.27 112.26,59.27 112.26,57.75 113.15,56.86 v113.15,54.95 | v136.14,49.49 136.01,49.37 136.01,38.82 136.52,38.32 136.52,36.54 135.5,35.52 135.5,22.06 135.38,21.93 135.38,6.69 135.63,6.44 135.63,5.68 v134.74,4.79 | v50.03,4.79 48.25,6.57 v48.25,15.58
  Bottom 0.203: v113.15,54.95 113.79,54.32 125.22,54.32 130.04,49.49 v136.14,49.49 | v134.74,4.79 133.22,3.26 103.5,3.26 102.74,4.03 95.12,4.03 93.85,2.76 52.57,2.76 50.54,4.79 v50.03,4.79 | v48.25,15.58 46.86,16.98 40.63,16.98 v38.73,18.88
DQ3  (via drill 0.61)
  Top 0.203: IC6.3 28.44,42.63 28.44,33.87 29.46,32.86 v29.46,31.97 | v39.75,29.93 40.63,29.04 IC8.8 | IC17.16 111.12,60.92 111.12,61.56 v111.37,61.81 | v121.53,60.03 v121.53,61.81 | v110.74,56.99 110.23,56.48 v110.23,54.45 | v74.04,53.56 72.39,51.91 v72.39,44.92 | v55.49,44.29 55.37,44.16 v55.37,31.08
  Bottom 0.203: v29.46,31.97 31.49,29.93 v39.75,29.93 39.87,30.06 54.35,30.06 v55.37,31.08 | v121.53,61.81 v111.37,61.81 | v121.53,60.03 119.12,57.62 111.37,57.62 v110.74,56.99 | v110.23,54.45 110.1,54.32 106.04,54.32 105.41,53.68 96.39,53.68 96.26,53.56 83.31,53.56 82.93,53.18 74.42,53.18 v74.04,53.56 | v72.39,44.92 72.39,46.7 57.91,46.7 v55.49,44.29
DQ4  (via drill 0.61)
  Top 0.203: v32.51,52.92 34.54,54.95 v34.54,67.91 | v45.33,69.18 45.71,69.56 IC9.11 | v101.21,66.64 v102.99,64.86
  Bottom 0.203: IC6.18 30.09,52.92 v32.51,52.92 | v34.54,67.91 35.81,69.18 v45.33,69.18 46.22,68.29 51.81,68.29 52.57,69.05 62.22,69.05 62.99,68.29 65.27,68.29 66.04,69.05 78.73,69.05 79.24,68.54 84.58,68.54 85.85,67.27 100.58,67.27 v101.21,66.64 | IC17.15 107.82,64.86 v102.99,64.86
DQ5  (via drill 0.61)
  Top 0.203: v38.98,52.41 v38.98,61.18 38.98,62.95 39.62,63.59 39.62,70.07 IC9.13 | v51.43,69.18 51.43,61.43 v51.94,60.92
  Bottom 0.203: IC6.16 34.67,52.41 v38.98,52.41 | IC17.14 107.44,67.78 85.97,67.78 84.7,69.05 79.37,69.05 78.86,69.56 65.91,69.56 65.15,68.8 63.11,68.8 62.35,69.56 51.81,69.56 v51.43,69.18 | v51.94,60.92 51.68,61.18 v38.98,61.18
DQ6  (via drill 0.61)
  Top 0.203: IC9.15 36.32,70.32 36.32,64.1 37.08,63.34 37.08,60.67 | 37.08,60.67 37.08,54.32 38.09,53.3 IC6.14 | IC17.13 108.2,69.56 108.2,71.84 108.33,71.97 108.33,72.73 v107.44,73.62 | v99.44,73.5 97.53,71.59 v97.53,59.65 | 37.08,60.67 v37.21,60.67
  Bottom 0.203: v107.44,73.62 107.31,73.5 v99.44,73.5 | v97.53,59.65 96.52,58.64 82.16,58.64 81.91,58.89 73.53,58.89 73.02,59.4 52.19,59.4 50.92,60.67 39.75,60.67 39.36,60.29 37.59,60.29 v37.21,60.67
DQ7  (via drill 0.61)
  Top 0.203: IC6.12 43.17,62.07 41.65,63.59 v41.65,70.07
  Bottom 0.203: IC9.17 31.49,70.07 v41.65,70.07 46.1,70.07 47.11,71.08 82.42,71.08 83.43,72.1 101.98,72.1 102.61,71.46 108.83,71.46 IC17.12
DQ8  (via drill 0.61)
  Top 0.203: IC9.2 24.76,62.83 24.76,51.52 23.87,50.64 v23.87,46.32 | v44.45,4.79 43.17,6.06 IC2.9 43.17,7.96 v45.97,10.76 | IC17.10 110.48,74.89 v110.48,67.78 | v138.3,68.03 139.06,67.27 v139.06,45.17 | v144.65,6.18 144.01,6.18 141.09,3.26 78.86,3.26 v78.86,4.66 | v58.29,5.68 54.99,8.98 v54.99,10.63
  Bottom 0.203: v23.87,46.32 13.58,46.32 13.08,46.83 7.62,46.83 1.14,40.35 1.14,7.84 21.2,7.84 24.38,4.66 40.25,4.66 40.63,5.04 44.19,5.04 v44.45,4.79 | v110.48,67.78 110.99,67.27 136.01,67.27 136.77,68.03 v138.3,68.03 | v139.06,45.17 152.4,45.17 161.03,36.54 161.03,8.85 147.19,8.85 145.79,7.46 145.79,6.18 v144.65,6.18 | v78.86,4.66 78.73,4.79 59.18,4.79 v58.29,5.68 | v54.99,10.63 54.86,10.76 v45.97,10.76
DQ9  (via drill 0.61)
  Top 0.203: v44.7,62.07 44.95,61.81 44.95,51.4 44.45,50.89 44.45,17.87 41.9,15.33 41.9,3.77 41.4,3.26 38.09,3.26 IC2.7 | IC17.9 111.37,76.54 v111.37,66.38 | v53.08,68.16 52.19,67.27 52.19,62.32 v52.32,62.19
  Bottom 0.203: IC9.4 31.87,62.07 v44.7,62.07 52.19,62.07 v52.32,62.19 | v111.37,66.38 109.98,64.99 108.33,64.99 107.56,65.75 87.24,65.75 86.23,66.76 85.72,66.76 84.7,67.78 79.37,67.78 78.61,68.54 66.16,68.54 65.4,67.78 62.86,67.78 62.48,68.16 v53.08,68.16
DQ10  (via drill 0.61)
  Top 0.203: IC2.5 35.17,5.42 35.17,5.3 35.68,4.79 37.08,4.79 37.08,12.79 39.11,14.82 39.11,16.85 40.13,17.87 40.13,23.46 41.65,24.98 41.65,39.71 41.4,39.97 41.4,42.51 41.65,42.76 41.65,51.52 v39.87,53.3 40,53.3 40,56.6 v42.29,58.89 | v36.32,53.81 36.32,62.7 IC9.6 | IC17.8 112.26,78.19 112.26,61.43 110.61,59.78 107.82,59.78 v107.82,58.76 | v98.93,58.51 97.79,57.37 96.13,57.37 v96.13,57.75
  Bottom 0.203: v39.87,53.3 39.36,53.81 v36.32,53.81 | v107.82,58.76 107.56,58.51 v98.93,58.51 | v96.13,57.75 95.75,58.13 82.04,58.13 81.78,58.38 73.4,58.38 72.89,58.89 v42.29,58.89
DQ11  (via drill 0.61)
  Top 0.203: IC2.3 26.67,8.85 26.67,50 26.92,50.25 v26.92,58.89 | IC9.8 v40.63,58.89 | v113.66,58.76 v113.66,83.66 | v110.61,58.38 109.09,56.86 107.82,56.86 v107.82,56.48 | v96.13,59.53 v97.4,58.26
  Bottom 0.203: v40.63,58.89 v26.92,58.89 | IC17.7 109.34,83.66 v113.66,83.66 | v113.66,58.76 113.28,58.38 v110.61,58.38 | v107.82,56.48 104.01,56.48 102.87,57.62 98.04,57.62 v97.4,58.26 | v96.13,59.53 96.01,59.4 73.66,59.4 73.15,59.91 55.88,59.91 51.3,64.48 41.65,64.48 IC9.8
DRL  (via drill 0.61)
  Top 0.203: IC7.5 72.64,9.11 72.64,12.41 v72.26,12.79 | v93.85,13.8 92.45,15.2 92.45,19.27 IC5.2
  Bottom 0.203: v72.26,12.79 72.89,13.42 93.47,13.42 v93.85,13.8
EA1  (via drill 0.61)
  Top 0.203: v58.92,92.16 56.64,89.88 54.35,89.88 54.35,84.8 SV1.5 | v70.73,32.98 72.64,31.08 72.64,20.79 v73.91,19.52 | v110.1,16.85 110.1,22.06 109.85,22.31 v109.85,32.6 | v149.47,34.51 147.31,36.67 IC10.11 147.31,44.67 146.3,45.68 146.3,85.05 v146.55,85.31 | v110.74,93.81 114.93,89.62 v114.93,86.58